# Altium schematic sheet l6.schdoc
size 234 x 113 mm
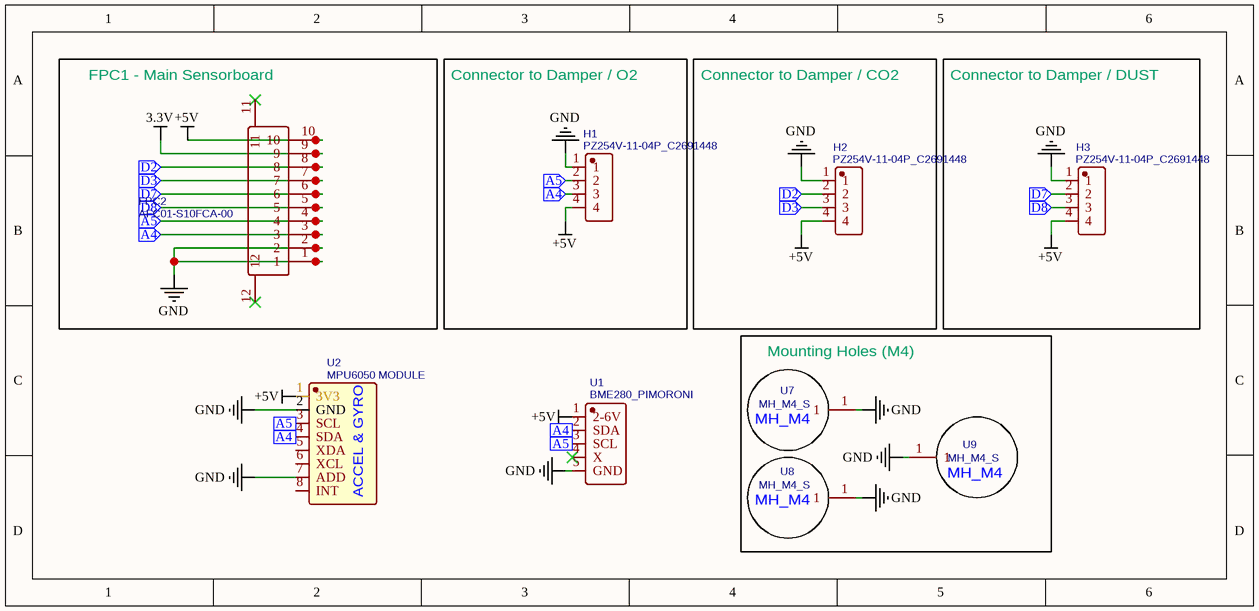
[diagram p0: l6.schdoc]

## Parts
FPC2  AFC01-S10FCA-00  [FPC-SMD_P0.5-10P_FGS-XJ-H2.0]
H1  PZ254V-11-04P_C2691448  [HDR-TH_4P-P2.54-V-M]
H2  PZ254V-11-04P_C2691448  [HDR-TH_4P-P2.54-V-M]
H3  PZ254V-11-04P_C2691448  [HDR-TH_4P-P2.54-V-M]
U1  BME280_PIMORONI  [BME280_PIMORONI]
U2  MPU6050 MODULE  [MPU6050]
U7  MH_M4_S  [MH_M4_PCB]
U8  MH_M4_S  [MH_M4_PCB]
U9  MH_M4_S  [MH_M4_PCB]

## Blocks framed on the sheet
FPC1 - Main Sensorboard: FPC2
Connector to Damper / O2: H1
Connector to Damper / CO2: H2
Connector to Damper / DUST: H3
Mounting Holes (M4): U7-U9

## Ports
A4 (in), A5 (in), D2 (in), D3 (in), D7 (in), D8 (in)

## Nets
3.3V: FPC2.9
+5V: FPC2.10 H1.4 H2.4 H3.4 U1.1(2-6V) U2.1(3V3)
GND: FPC2.1 FPC2.2 H1.1 H2.1 H3.1 U1.5(GND) U2.2(GND) U2.7(ADD) U7.1 U8.1 U9.1
A4: FPC2.3 H1.3 U1.2(SDA) U2.4(SDA) ; port A4
A5: FPC2.4 H1.2 U1.3(SCL) U2.3(SCL) ; port A5
D2: FPC2.8 H2.2 ; port D2
D3: FPC2.7 H2.3 ; port D3
D7: FPC2.6 H3.2 ; port D7
D8: FPC2.5 H3.3 ; port D8

Not connected (* = marked no-connect by the designer): FPC2 11* 12*; U1 4(X)*; U2 5(XDA) 6(XCL) 8(INT)

## Notes on the sheet
- (in symbol MH_M4_S) MH_M4
- (in symbol MPU6050 MODULE) ACCEL & GYRO

## Library data of the parts
FPC2 = AFC01-S10FCA-00: Manufacturer: JS(钜硕电子); Contributor: LCSC; Supplier: LCSC; Supplier Part: C262659; Manufacturer Part: AFC01-S10FCA-00; JLCPCB Part Class: Extended Part; spicePre: F; spiceSymbolName: AFC01-S10FCA-00
H1-H3 = PZ254V-11-04P_C2691448: Manufacturer: XFCN(兴飞); Contributor: LCSC; Supplier: LCSC; Supplier Part: C2691448; Manufacturer Part: PZ254V-11-04P; JLCPCB Part Class: Extended Part; spicePre: H; spiceSymbolName: PZ254V-11-04P_C2691448
U1 = BME280_PIMORONI: Manufacturer: ReliaPro; Manufacturer Part: 2.54mm 1*5P Header; Contributor: axelvendeville.v2; Supplier Part: C50951; spicePre: U; spiceSymbolName: BME280_PIMORONI
U2 = MPU6050 MODULE: Contributor: jofenix; Manufacturer Part: MPU6050; Supplier: Aliexpress; spicePre: U; spiceSymbolName: MPU6050 MODULE
U7-U9 = MH_M4_S: Contributor: js314dev; spicePre: U; spiceSymbolName: MH_M4_S